# Altium project SmartIMU-BAT.PrjPCB
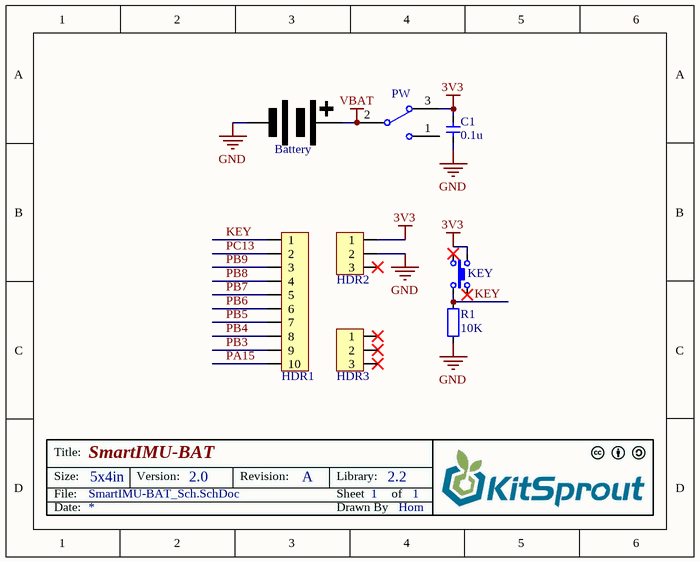
[diagram p0: SmartIMU-BAT_Sch.SchDoc]
1 sheet, 8 parts. Net scope: global (net labels, ports and power ports of the same name join across sheets).
Board file: SmartIMU-BAT_Pcb.PcbDoc

## Sheet SmartIMU-BAT_Sch.SchDoc: SmartIMU-BAT
size 127 x 101 mm; Author: Hom; CompanyName: KitSprout; DrawnBy: Hom; Engineer: Hom; Organization: KitSprout; Revision: A; SheetNumber: 1; SheetTotal: 1; Version: 2.0; LibVersion: 2.2; PageSetup: Record=PageOptions|CenterHorizontal=True|CenterVertical=True|PrintScale=1.00|XCorrection=1.00|YCorrection=1.00|PrintKind=0|BorderSize=5000000|LeftOffset=0|BottomOffset=0|Orientation=2|PaperLength=1000|PaperWidth=1000|Scale=100|PaperSource=7|PrintQuality=-3|MediaType=1|DitherType=10|PrintScaleMode=0|PaperKind=A4|PaperIndex=9

### Parts
Battery  Battery  [CR2032-1]  (value not drawn)
C1  value 0.1u  [CAP_0603]  (hidden comment: Cap_0603)
HDR1  HDR1x10_2.54  [HDR1X10_2.54_180F]  (value not drawn)
HDR2  HDR1x3_2.54  [HDR1X3_2.54_180F]  (value not drawn)
HDR3  HDR1x3_2.54  [HDR1X3_2.54_180F]  (value not drawn)
KEY  ButtonTACT  [ButtonTACT_3.5*3.55_90]  (value not drawn)
PW  SwitchSPDT_2.8x6.6_90  [SwitchSPDT_2.8X6.6_90]  (value not drawn)
R1  value 10K  [RES_0603]  (hidden comment: Res_0603)

### Nets
3V3: C1.1 HDR2.1 KEY.1 PW.3
GND: Battery.1(-) C1.2 HDR2.2 R1.1
VBAT: Battery.2(+) PW.2
KEY: HDR1.1 KEY.4 R1.2
PA15: HDR1.10
PB3: HDR1.9
PB4: HDR1.8
PB5: HDR1.7
PB6: HDR1.6
PB7: HDR1.5
PB8: HDR1.4
PB9: HDR1.3
PC13: HDR1.2

Not connected (* = marked no-connect by the designer): HDR2 3*; HDR3 1* 2* 3*; KEY 2* 3*; PW 1

### Notes on the sheet
- Title:
- Size:
- Date:
- File:
- 5x4in
- Version:
- Revision:
- Sheet
- Drawn By
- Library:
- of

### Library data of the parts
C1 = Cap_0603: Capacitor
HDR1 = HDR1x10_2.54: Header
HDR2 HDR3 = HDR1x3_2.54T: Header
KEY = ButtonTACT: Button
PW = SwitchSPDT_2.8x6.6_90: Switch
R1 = Res_0603: Resistor